# EAGLE design Diagrama_secudário (EAGLE 9.4.2)
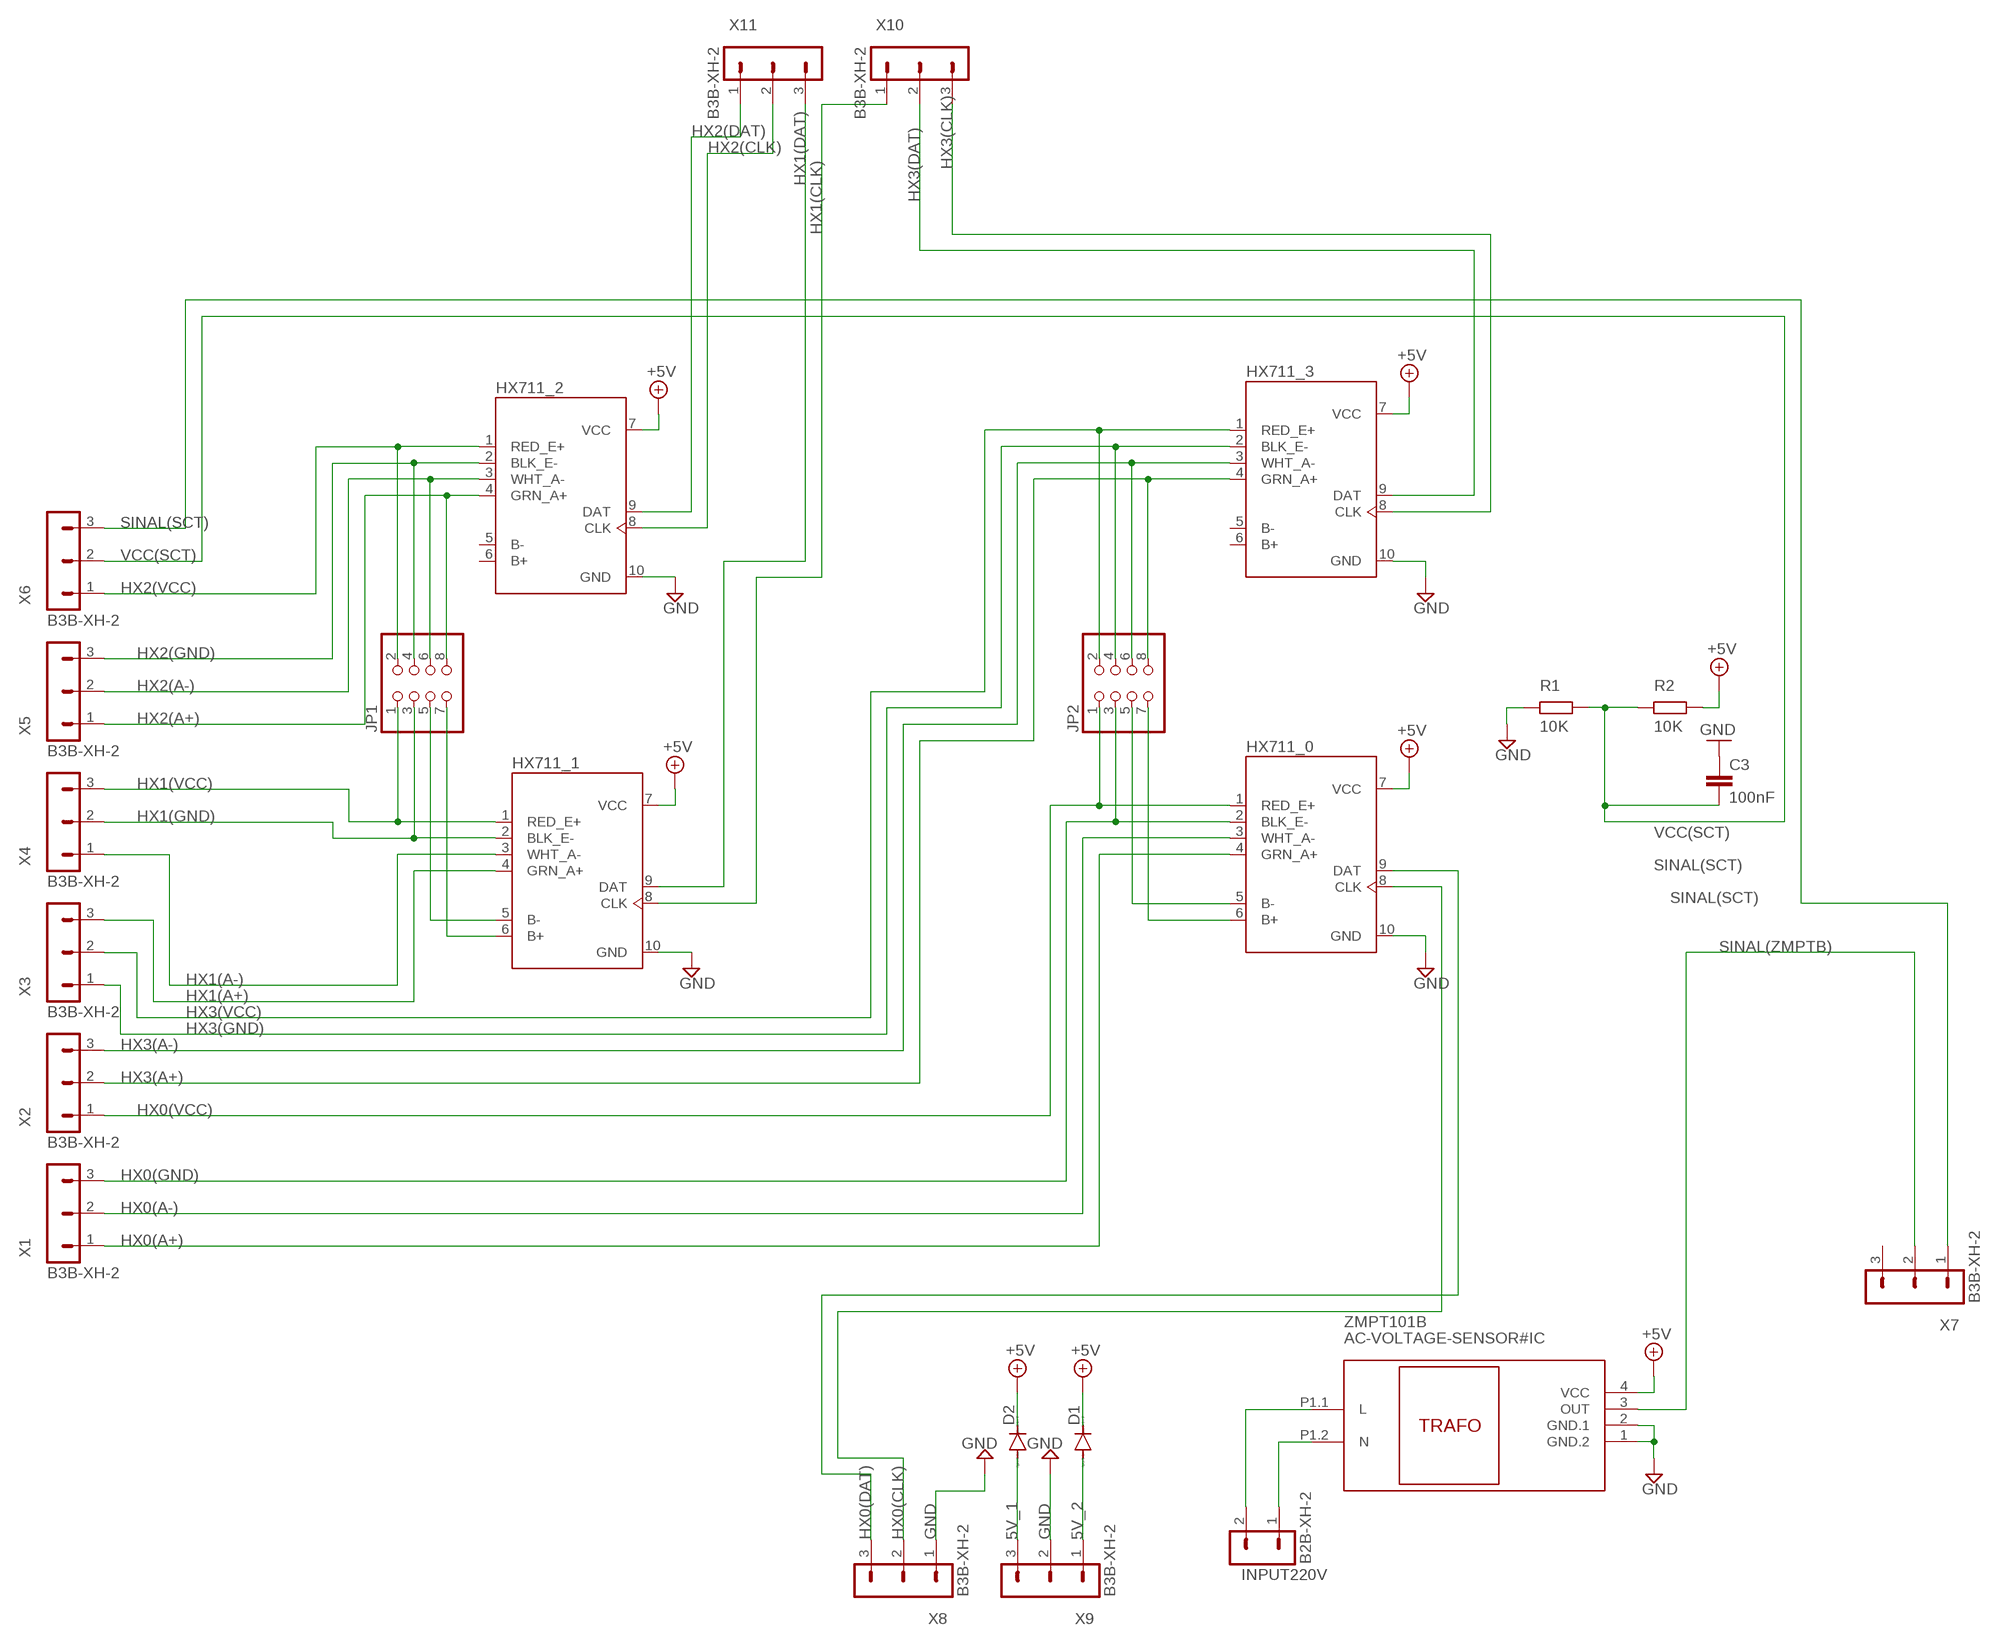
[diagram p0: schematic, sheet 1]

## Parts
C3  100nF  C-EU050-025X075  [C050-025X075]
D1  1N4148DO35-7  [DO35-7]
D2  1  1N4148DO35-7  [DO35-7]
HX711_0  HX711MODULO  [HX711MODULO]
HX711_1  HX711MODULO  [HX711MODULO]
HX711_2  HX711MODULO  [HX711MODULO]
HX711_3  HX711MODULO  [HX711MODULO]
INPUT220V  B2B-XH-2  [B2B-XH-A]
JP1  PINHD-2X4  [2X04]
JP2  PINHD-2X4  [2X04]
R1  10K  1K1/4RESISTOR  [1/4W-0.41K]
R2  10K  1K1/4RESISTOR  [1/4W-0.41K]
X1  B3B-XH-2  [B3B-XH-A]
X2  B3B-XH-2  [B3B-XH-A]
X3  B3B-XH-2  [B3B-XH-A]
X4  B3B-XH-2  [B3B-XH-A]
X5  B3B-XH-2  [B3B-XH-A]
X6  B3B-XH-2  [B3B-XH-A]
X7  B3B-XH-2  [B3B-XH-A]
X8  B3B-XH-2  [B3B-XH-A]
X9  B3B-XH-2  [B3B-XH-A]
X10  B3B-XH-2  [B3B-XH-A]
X11  B3B-XH-2  [B3B-XH-A]
ZMPT101B  AC-VOLTAGE-SENSOR#IC  [AC-VOLTAGE-SENSOR#IC]

## Nets
5V_1: D2.A X9.3
5V_2: D1.A X9.1
+5V: D1.C D2.C HX711_0.7(VCC) HX711_1.7(VCC) HX711_2.7(VCC) HX711_3.7(VCC) R2.2 ZMPT101B.4(VCC)
GND: C3.1 HX711_0.10(GND) HX711_1.10(GND) HX711_2.10(GND) HX711_3.10(GND) R1.1 X8.1 X9.2 ZMPT101B.1(GND.2) ZMPT101B.2(GND.1)
HX0(A+): HX711_0.4(GRN_A+) X1.1
HX0(A-): HX711_0.3(WHT_A-) X1.2
HX0(B+): HX711_0.6(B+) JP2.7
HX0(B-): HX711_0.5(B-) JP2.5
HX0(CLK): HX711_0.8(CLK) X8.2
HX0(DAT): HX711_0.9(DAT) X8.3
HX0(GND): HX711_0.2(BLK_E-) JP2.3 X1.3
HX0(VCC): HX711_0.1(RED_E+) JP2.1 X2.1
HX1(A+): HX711_1.4(GRN_A+) X3.3
HX1(A-): HX711_1.3(WHT_A-) X4.1
HX1(B+): HX711_1.6(B+) JP1.7
HX1(B-): HX711_1.5(B-) JP1.5
HX1(CLK): HX711_1.8(CLK) X10.1
HX1(DAT): HX711_1.9(DAT) X11.3
HX1(GND): HX711_1.2(BLK_E-) JP1.3 X4.2
HX1(VCC): HX711_1.1(RED_E+) JP1.1 X4.3
HX2(A+): HX711_2.4(GRN_A+) JP1.8 X5.1
HX2(A-): HX711_2.3(WHT_A-) JP1.6 X5.2
HX2(CLK): HX711_2.8(CLK) X11.2
HX2(DAT): HX711_2.9(DAT) X11.1
HX2(GND): HX711_2.2(BLK_E-) JP1.4 X5.3
HX2(VCC): HX711_2.1(RED_E+) JP1.2 X6.1
HX3(A+): HX711_3.4(GRN_A+) JP2.8 X2.2
HX3(A-): HX711_3.3(WHT_A-) JP2.6 X2.3
HX3(CLK): HX711_3.8(CLK) X10.3
HX3(DAT): HX711_3.9(DAT) X10.2
HX3(GND): HX711_3.2(BLK_E-) JP2.4 X3.1
HX3(VCC): HX711_3.1(RED_E+) JP2.2 X3.2
N$1: INPUT220V.1 ZMPT101B.P1.2(N)
N$2: INPUT220V.2 ZMPT101B.P1.1(L)
SINAL(SCT): X6.3 X7.1
SINAL(ZMPTB): X7.2 ZMPT101B.3(OUT)
VCC(SCT): C3.2 R1.2 R2.1 X6.2
Unconnected: HX711_2.5(B-) HX711_2.6(B+) HX711_3.5(B-) HX711_3.6(B+) X7.3

## Library data of the parts
C3 = rcl:C-EU: CAPACITOR, European symbol; SPICEPREFIX: C
D1 = diode:1N4148: DIODE high speed (Philips); SPICEPREFIX: D
D2 = diode:1N4148: DIODE high speed (Philips)
HX711_0 HX711_1-HX711_3 = minha biblioteca:HX711MODULO: Load Cell Amp Hx711; AVAILABILITY: Unavailable; DESCRIPTION: Load Cell Amp Hx711; MF: SparkFun; MP: SEN-13879; PACKAGE: None; PRICE: None
INPUT220V = con-JST XH:B2B-XH: JST XH series header 2.50mm pitch disconnectable crimp style connectors, vertical (side entry type), 2 pins
JP1 JP2 = pinhead:PINHD-2X4: PIN HEADER
R1 R2 = resistors:1K1/4RESISTOR
X1-X11 = con-JST XH:B3B-XH: JST XH series header 2.50mm pitch disconnectable crimp style connectors, vertical (side entry type), 3 pins
ZMPT101B = diy-modules:AC-VOLTAGE-SENSOR#IC: Isolated AC Voltage Sensor based on ZMPT101B transformer Symbol with input connector ZMPT101B Voltage Transformer Operating Guide is available here: http://www.zeming-e.com/file/0_2013_10_18_093344.pdf Click here to find device on ebay.com <http://www.ebay.com/sch/arduino+voltage+transformer>

## Board
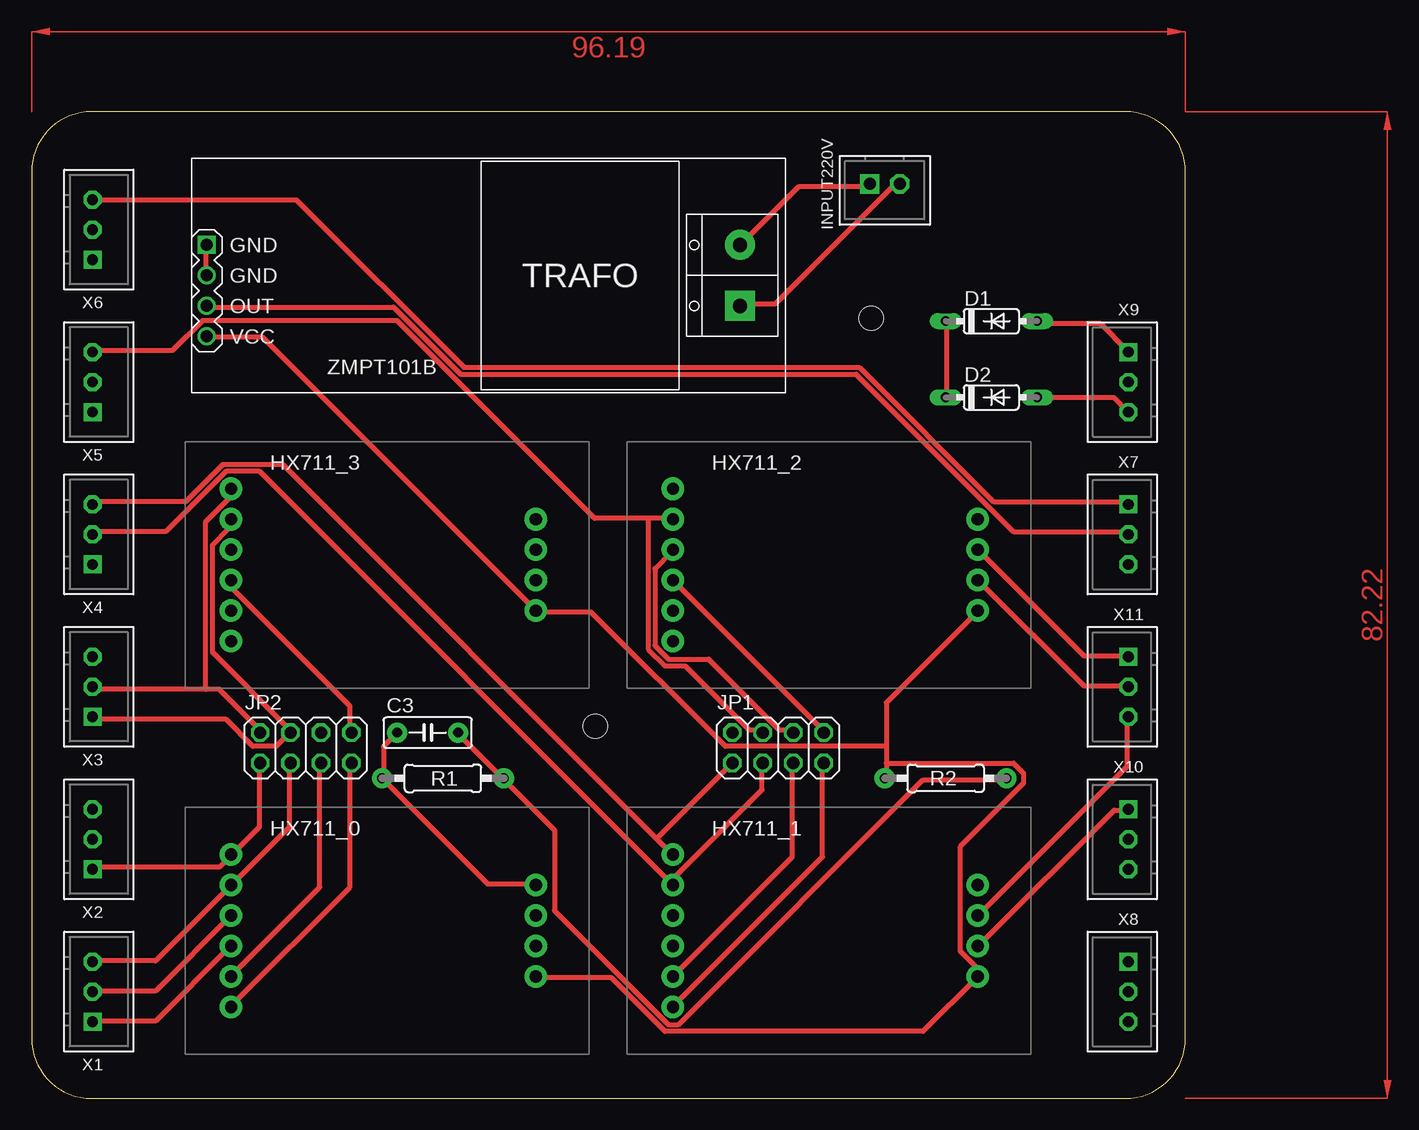
[diagram p1: board, top side]
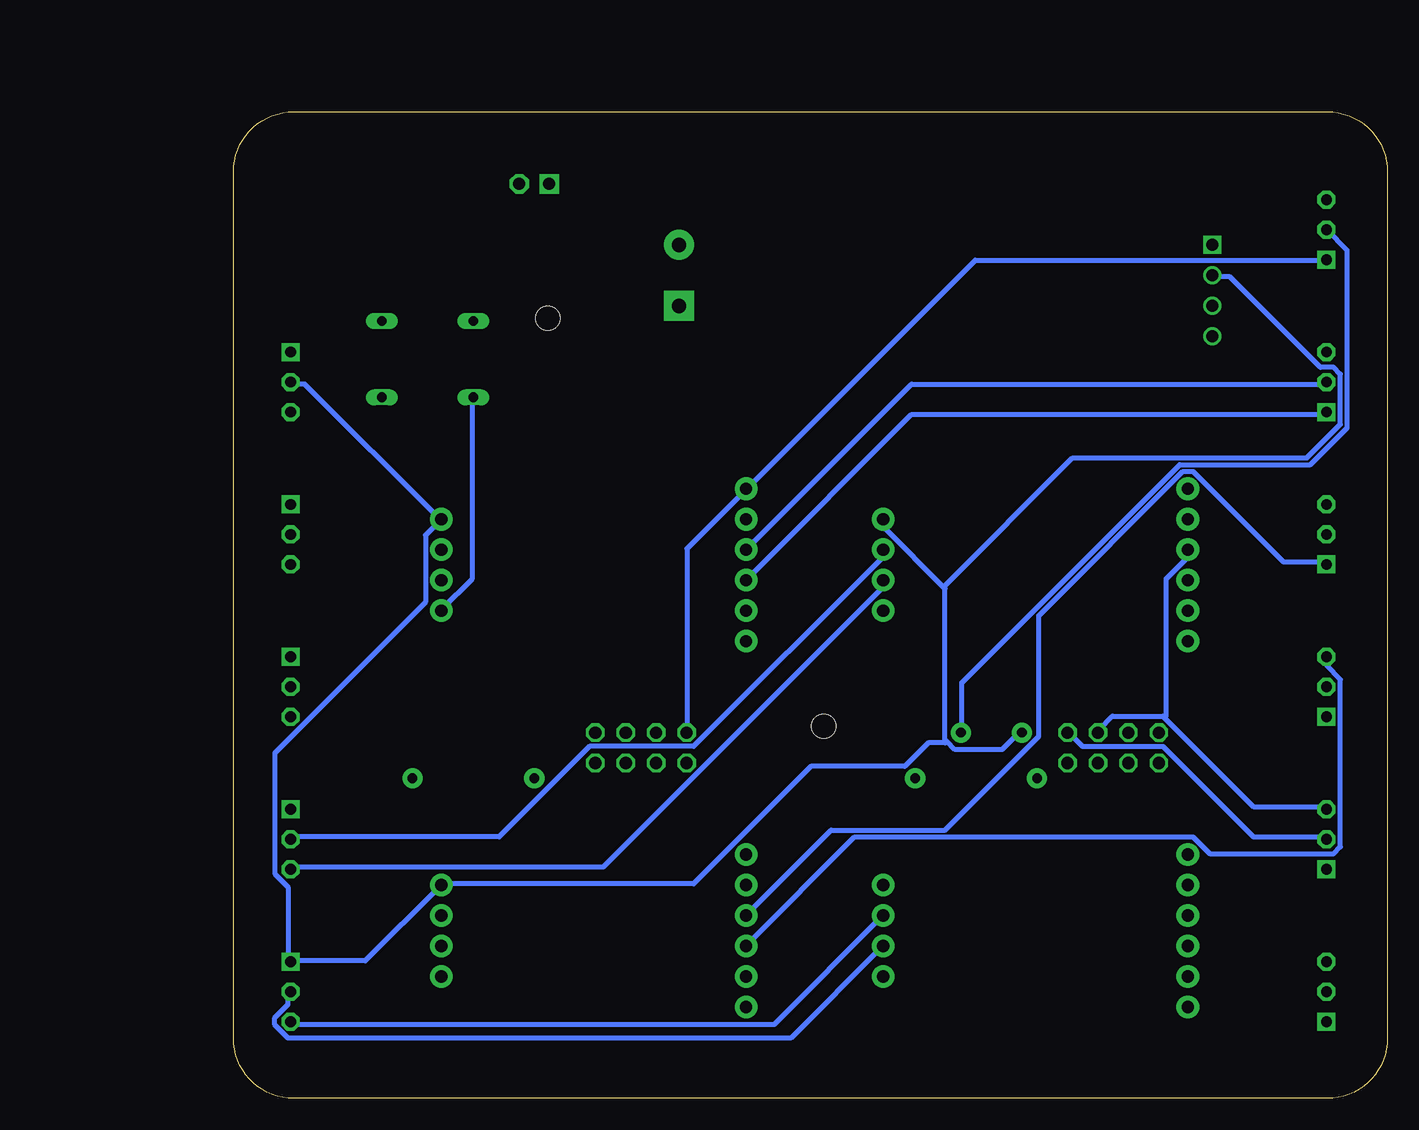
[diagram p2: board, bottom side, seen from below]

Size 96.19 x 82.22 mm. Coordinates in mm from the lower left corner, seen from the top.
Outline: 0,77.22 0,5 arc90 5,0 91.19,0 arc90 96.19,5 96.19,77.22 arc90 91.19,82.22 5,82.22 arc90 0,77.22
Copper layers (1*16): Top 0.035mm / dielectric 1.5mm / Bottom 0.035mm
Design rules "default *": minimum track width 16mil, minimum drill 0.35mm, track to track 6mil, track to pad 6mil, pad to pad 6mil, via to via 6mil, smd to smd 6mil, copper to edge 40mil, drill to drill 6mil, minimum pad ring 10mil, minimum via ring 8mil, stop-mask expansion 4mil, vias tented up to drill 0mil, thermal gap 10mil
Holes 2 mm at 47,31 70,65

### Footprints (pad centres in the part's own frame; a part is rotated, then mirrored left to right if it is on the bottom)
C050-025X075 = drill 0.813 pad 1.676: 1 -2.54,0; 2 2.54,0
DO35-7 = drill 0.813 long: A 3.81,0; C -3.81,0
HX711MODULO = drill 1.016 pad 1.88: 1 -13.843,6.35; 2 -13.843,3.81; 3 -13.843,1.27; 4 -13.843,-1.27; 5 -13.843,-3.81; 6 -13.843,-6.35; 7 11.557,-3.81; 8 11.557,-1.27; 9 11.557,1.27; 10 11.557,3.81
B2B-XH-A = drill 1 pad 1.6 square: 1 1.25,0 | drill 1 pad 1.6 octagon: 2 -1.25,0
2X04 = drill 1.016 octagon: 1 -3.81,-1.27; 2 -3.81,1.27; 3 -1.27,-1.27; 4 -1.27,1.27; 5 1.27,-1.27; 6 1.27,1.27; 7 3.81,-1.27; 8 3.81,1.27
1/4W-0.41K = drill 0.813 pad 1.676: 1 -5.08,0; 2 5.08,0
B3B-XH-A = drill 0.9 pad 1.5 square: 1 2.5,0 | drill 0.9 pad 1.5 octagon: 2 0,0; 3 -2.5,0
AC-VOLTAGE-SENSOR#IC = drill 1 square: 1 23.495,-2.54 | drill 1: 2 23.495,0; 3 23.495,2.54; 4 23.495,5.08 | drill 1.2 pad 2.5 square: P1.1 -20.955,2.54 | drill 1.2 pad 2.5: P1.2 -20.955,-2.54

### Placement (x,y rotation side)
C3  33.02,30.48 0 top
D1  80.01,64.77 0 top
D2  80.01,58.42 0 top
HX711_0  30.48,13.97 0 top
HX711_1  67.31,13.97 0 top
HX711_2  67.31,44.45 0 top
HX711_3  30.48,44.45 0 top
INPUT220V  71.12,76.2 180 top
JP1  62.23,29.21 0 top
JP2  22.86,29.21 0 top
R1  34.29,26.67 0 top
R2  76.2,26.67 180 top
X1  5.08,8.89 270 top
X2  5.08,21.59 270 top
X3  5.08,34.29 270 top
X4  5.08,46.99 270 top
X5  5.08,59.69 270 top
X6  5.08,72.39 270 top
X7  91.44,46.99 90 top
X8  91.44,8.89 90 top
X9  91.44,59.69 90 top
X10  91.44,21.59 90 top
X11  91.44,34.29 90 top
ZMPT101B  38.1,68.58 180 top

### Tracks (layer width: path | path; a pad name or v marks a point on that pad's centre or on a via)
5V_1
  Top 0.406: D2.A 83.82,58.4 90.25,58.4 91.36,57.28 X9.3
5V_2
  Top 0.406: D1.A 83.82,64.54 89.13,64.54 91.36,62.31 X9.1
+5V
  Top 0.406: ZMPT101B.4 14.81,63.42 19.28,63.42 41.91,40.79 HX711_3.7 42.19,40.51 46.66,40.51 57.84,29.34 71.25,29.34 | HX711_0.7 42.19,10.06 48.34,10.06 52.81,5.59 74.32,5.59 78.79,10.06 HX711_1.7 78.79,10.34 78.79,10.9 77.39,12.29 77.39,20.95 82.7,26.26 82.7,27.1 81.86,27.94 71.25,27.94 | D2.C 76.28,58.67 76.28,64.54 D1.C | 71.25,29.34 71.25,32.97 78.79,40.51 HX711_2.7 | 71.25,29.34 71.25,27.94 | 71.25,27.94 71.25,26.82 R2.2
  Bottom 0.406: D2.C 76.28,58.4 76.28,43.31 78.79,40.79 HX711_2.7
GND
  Top 0.406: ZMPT101B.2 14.53,68.73 14.53,70.97 ZMPT101B.1 | C3.1 29.34,29.34 29.34,26.82 R1.1 38,17.88 41.91,17.88 HX711_0.10
  Bottom 0.406: X9.2 91.36,59.51 90.25,59.51 79.07,48.34 HX711_2.10 80.19,46.94 80.19,41.35 92.76,28.78 92.76,18.72 91.64,17.6 91.64,11.46 X8.1 91.36,11.46 85.22,11.46 79.07,17.6 HX711_1.10 78.79,17.88 57.84,17.88 48.06,27.66 40.23,27.66 38.28,29.62 36.88,29.62 36.74,29.76 | 37.02,42.61 36.88,42.47 36.88,29.9 36.74,29.76 | 37.02,42.61 41.91,47.5 41.91,48.06 HX711_3.10 | 36.74,29.76 36.04,29.06 32.13,29.06 30.73,30.45 C3.1 | 37.02,42.61 26.26,53.37 6.71,53.37 3.91,56.16 3.91,60.35 4.47,60.91 5.59,60.91 13.13,68.45 14.53,68.45 ZMPT101B.2
HX0(A+)
  Top 0.406: X1.1 5.31,6.43 10.34,6.43 16.48,12.57 HX711_0.4
HX0(A-)
  Top 0.406: HX711_0.3 10.34,8.94 5.31,8.94 X1.2
HX0(B+)
  Top 0.406: JP2.7 26.54,27.94 26.54,17.6 16.76,7.82 HX711_0.6
HX0(B-)
  Top 0.406: JP2.5 24.03,27.94 24.03,17.6 16.76,10.34 HX711_0.5
HX0(CLK)
  Bottom 0.406: X8.2 91.64,8.66 91.64,7.82 92.76,6.71 92.76,6.15 91.64,5.03 49.73,5.03 42.19,12.57 HX711_0.8
HX0(DAT)
  Bottom 0.406: HX711_0.9 51.13,6.15 91.36,6.15 X8.3
HX0(GND)
  Top 0.406: X1.3 5.31,11.46 10.34,11.46 16.48,17.6 HX711_0.2 16.76,17.88 21.51,22.63 21.51,27.94 JP2.3
HX0(VCC)
  Top 0.406: X2.1 5.31,19.28 15.65,19.28 16.48,20.12 HX711_0.1 16.76,20.4 19,22.63 19,27.94 JP2.1
HX1(A+)
  Bottom 0.406: X3.3 5.03,36.6 5.03,36.04 3.91,34.92 3.91,20.95 4.47,20.4 14.81,20.4 16.2,21.79 44.42,21.79 53.37,12.85 HX711_1.4
HX1(A-)
  Bottom 0.406: X4.1 5.31,44.7 8.66,44.7 16.2,52.25 17.04,52.25 29.06,40.23 29.06,30.18 36.88,22.35 46.38,22.35 53.37,15.37 HX711_1.3
HX1(B+)
  Top 0.406: JP1.7 65.94,27.94 65.94,20.12 53.65,7.82 HX711_1.6
HX1(B-)
  Top 0.406: HX711_1.5 63.42,20.12 63.42,27.94 JP1.5
HX1(CLK)
  Top 0.406: X10.1 91.36,24.03 90.25,24.03 79.07,12.85 HX711_1.8
HX1(DAT)
  Top 0.406: X11.3 91.36,31.57 91.36,27.66 79.07,15.37 HX711_1.9
HX1(GND)
  Top 0.406: X4.2 5.31,47.22 11.18,47.22 16.2,52.25 19,52.25 HX711_1.2 53.37,18.16 60.91,25.7 60.91,27.94 JP1.3
HX1(VCC)
  Top 0.406: 52.11,21.65 53.37,20.4 HX711_1.1 | 52.11,21.65 20.95,52.81 15.93,52.81 12.85,49.73 5.31,49.73 X4.3 | 52.11,21.65 58.4,27.94 JP1.1
HX2(A+)
  Top 0.406: JP1.8 65.94,30.73 53.65,43.03 HX711_2.4
  Bottom 0.406: X5.1 5.31,57 39.67,57 53.37,43.31 HX711_2.4
HX2(A-)
  Top 0.406: JP1.6 63.42,30.73 62.31,30.73 56.44,36.6 53.09,36.6 51.97,37.72 51.97,44.15 53.37,45.54 HX711_2.3
  Bottom 0.406: HX711_2.3 39.67,59.51 5.31,59.51 X5.2
HX2(CLK)
  Top 0.406: X11.2 91.36,34.37 87.73,34.37 79.07,43.03 HX711_2.8
HX2(DAT)
  Top 0.406: X11.1 91.36,36.88 87.73,36.88 79.07,45.54 HX711_2.9
HX2(GND)
  Top 0.406: 51.41,48.34 53.37,48.34 HX711_2.2 | 51.41,48.34 46.94,48.34 30.45,64.82 14.25,64.82 11.73,62.31 5.31,62.31 X5.3 | 51.41,48.34 51.41,37.44 52.81,36.04 54.48,36.04 59.79,30.73 60.91,30.73 JP1.4
HX2(VCC)
  Bottom 0.406: X6.1 5.31,69.85 34.37,69.85 53.37,50.85 HX711_2.1 53.65,50.57 58.4,45.82 58.4,30.73 JP1.2
HX3(A+)
  Top 0.406: HX711_3.4 16.76,43.03 16.76,42.47 26.54,32.69 26.54,30.73 JP2.8
  Bottom 0.406: X2.2 5.31,21.79 11.18,21.79 18.72,29.34 25.43,29.34 26.54,30.45 JP2.8
HX3(A-)
  Bottom 0.406: 18.58,31.71 18.72,31.85 22.91,31.85 24.03,30.73 JP2.6 | 18.58,31.71 11.18,24.31 5.31,24.31 X2.3 | HX711_3.3 16.76,45.54 16.76,44.98 18.44,43.31 18.44,31.85 18.58,31.71
HX3(CLK)
  Bottom 0.406: X10.3 91.36,19.28 65.38,19.28 42.19,42.47 42.19,43.03 HX711_3.8
HX3(DAT)
  Bottom 0.406: X10.2 91.36,21.79 74.04,21.79 66.5,29.34 57.84,29.34 42.19,44.98 42.19,45.54 HX711_3.9
HX3(GND)
  Top 0.406: X3.1 5.31,31.57 16.2,31.57 18.44,29.34 20.4,29.34 21.51,30.45 JP2.4 21.51,30.73 15.09,37.16 15.09,46.1 16.48,47.5 16.48,48.06 HX711_3.2
HX3(VCC)
  Top 0.406: 14.53,34.09 15.65,34.09 19,30.73 JP2.2 | 14.53,34.09 5.31,34.09 X3.2 | 14.53,34.09 14.53,48.06 16.48,50.01 16.48,50.57 HX711_3.1
N$1
  Top 0.406: INPUT220V.1 69.85,76 63.98,76 59.23,71.25 ZMPT101B.P1.2
N$2
  Top 0.406: INPUT220V.2 72.36,76 71.81,76 62.03,66.22 59.23,66.22 ZMPT101B.P1.1
SINAL(SCT)
  Top 0.406: X7.1 91.36,49.73 80.19,49.73 69.01,60.91 36.04,60.91 22.07,74.88 5.31,74.88 X6.3
SINAL(ZMPTB)
  Top 0.406: X7.2 91.36,47.22 81.86,47.22 68.73,60.35 35.76,60.35 30.18,65.94 14.81,65.94 ZMPT101B.3
VCC(SCT)
  Top 0.406: C3.2 35.48,30.45 39.12,26.82 R1.2 39.4,26.54 43.59,22.35 43.59,15.65 53.09,6.15 53.92,6.15 74.32,26.54 81.03,26.54 R2.1
  Bottom 0.406: X6.2 5.03,72.36 3.35,70.69 3.35,55.88 6.43,52.81 17.32,52.81 35.48,34.65 35.48,30.73 C3.2
(copper drawn outside any net)
  shapes: Top area x2